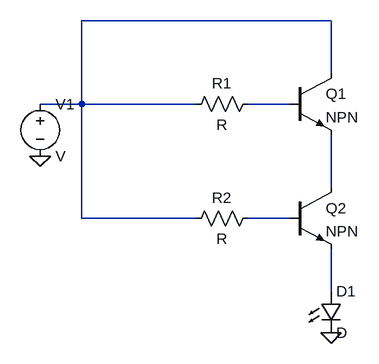
[diagram p0: schematic AND gate.asc]
AND gate.asc, the LTspice schematic file:
Version 4
SHEET 1 880 680
WIRE 208 0 -176 0
WIRE 208 80 208 0
WIRE -176 128 -176 0
WIRE -176 128 -240 128
WIRE 0 128 -176 128
WIRE 144 128 80 128
WIRE 208 256 208 176
WIRE -176 304 -176 128
WIRE 0 304 -176 304
WIRE 144 304 80 304
WIRE 208 416 208 352
FLAG 208 480 0
FLAG -240 208 0
SYMBOL npn 144 80 R0
SYMATTR InstName Q1
SYMBOL npn 144 256 R0
SYMATTR InstName Q2
SYMBOL LED 192 416 R0
SYMATTR InstName D1
SYMBOL res 96 112 R90
WINDOW 0 0 56 VBottom 2
WINDOW 3 32 56 VTop 2
SYMATTR InstName R1
SYMBOL res 96 288 R90
WINDOW 0 0 56 VBottom 2
WINDOW 3 32 56 VTop 2
SYMATTR InstName R2
SYMBOL voltage -240 112 R0
SYMATTR InstName V1

The netlist it stands for:
* AND gate.asc
Q1 N001 N002 N003 0 NPN
Q2 N003 N004 N005 0 NPN
D1 N005 0 D
R1 N002 N001 R
R2 N004 N001 R
V1 N001 0 V
.model D D
.lib standard.dio
.model NPN NPN
.model PNP PNP
.lib standard.bjt
.backanno
.end